# Altium schematic sheet SH29 - EXPANSION3.SchDoc
size 386 x 246 mm
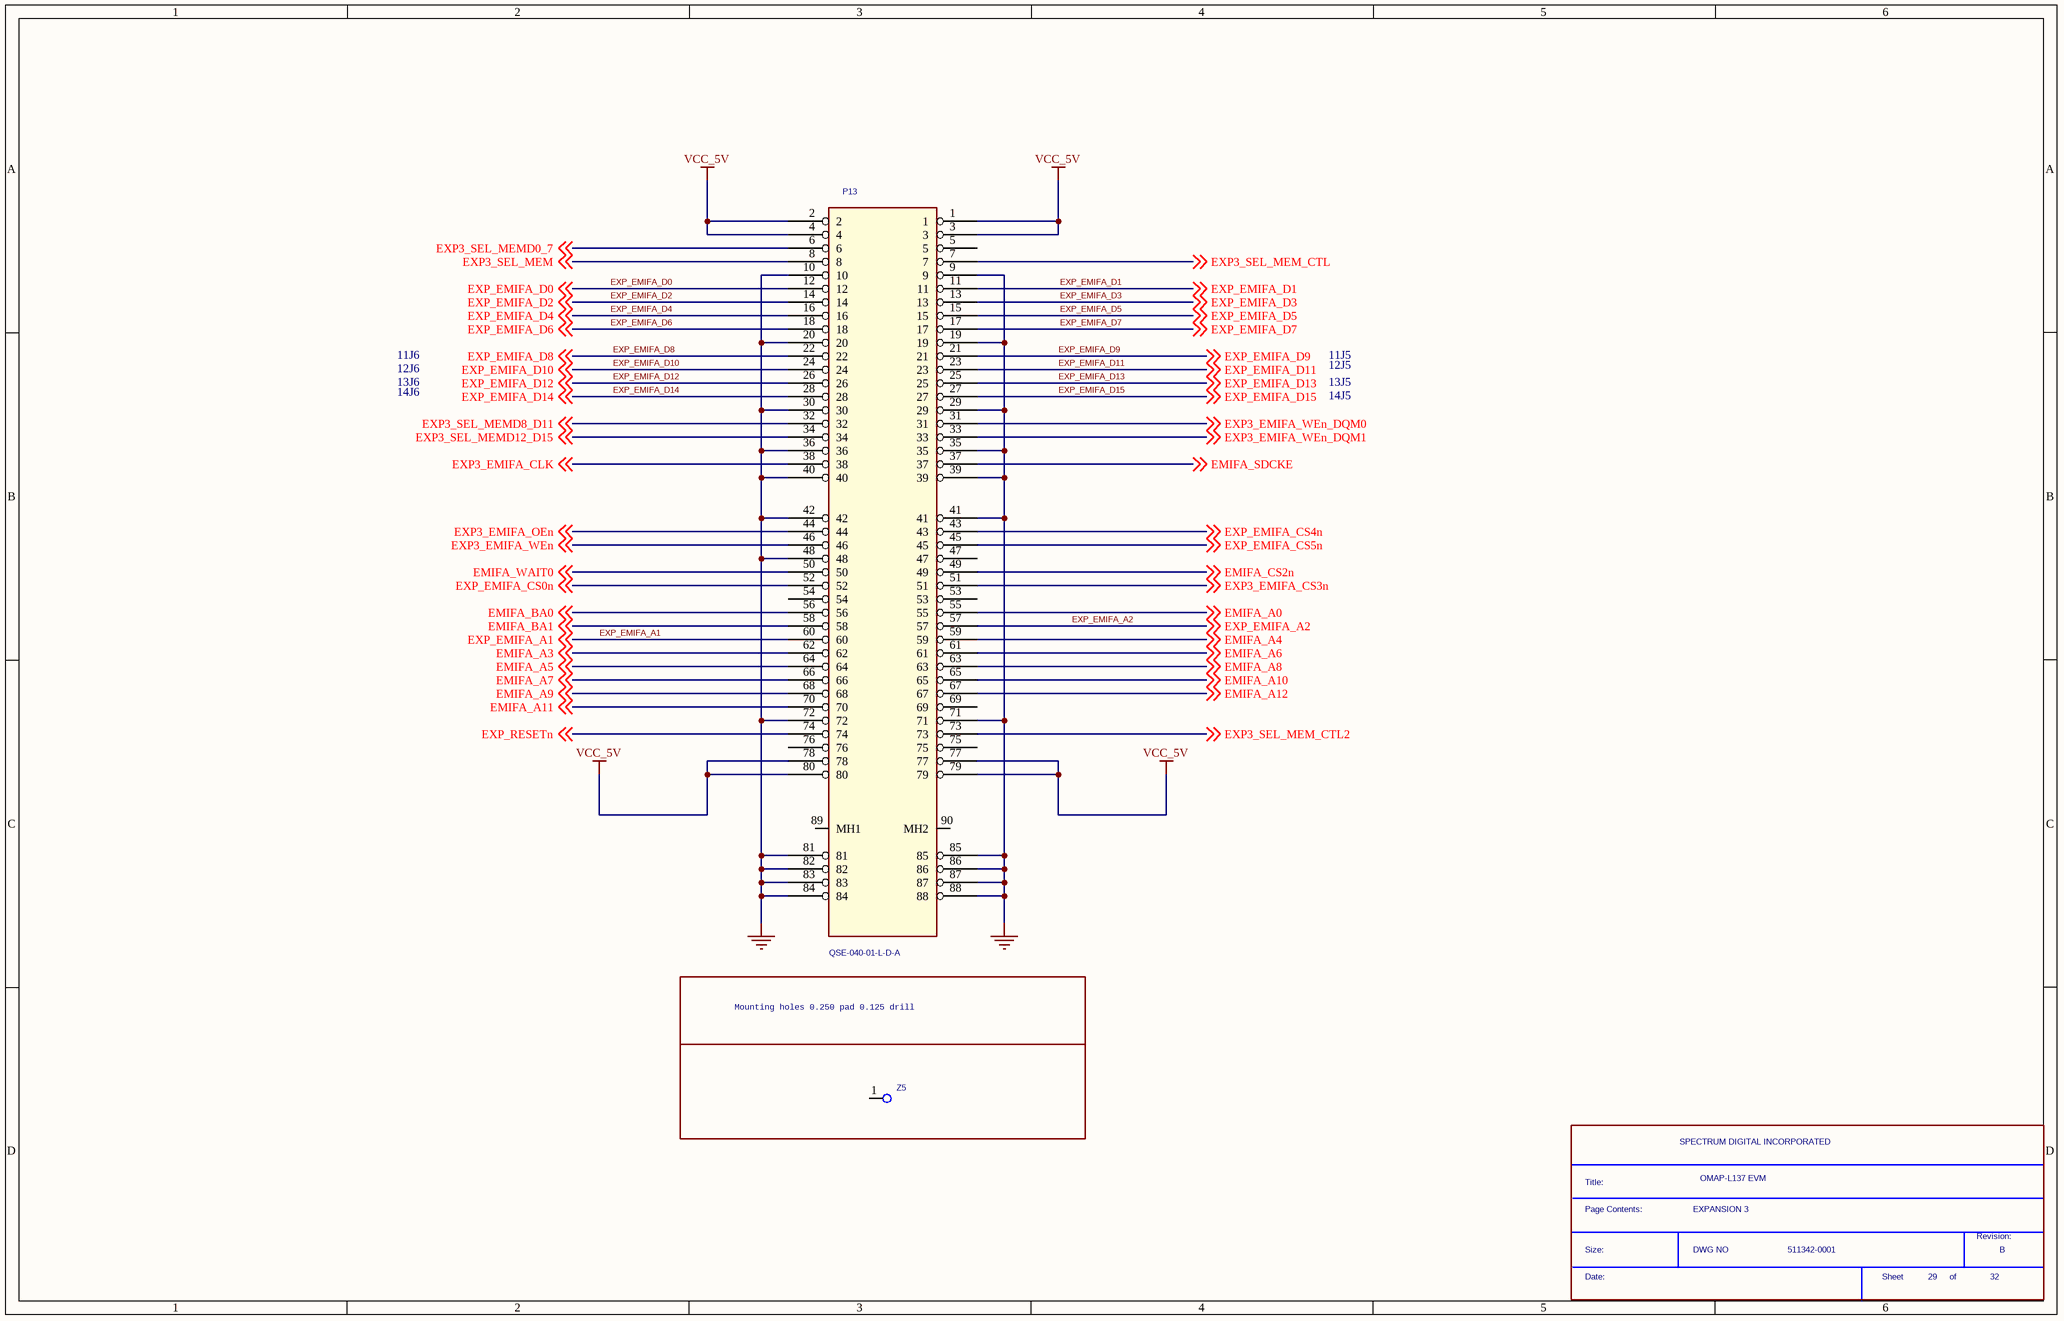
[diagram p0: SH29 - EXPANSION3.SchDoc]

## Parts
*  Page Contents:: EXPANSION 3  RevCode: B  Title: OMAP-L137 EVM  OrgName: SPECTRUM DIGITAL INCORPORATED  Doc: 511342-0001  Page Number: 29  Page Count: 32  (hidden comment: SDTitleBlock)  (graphical)
P13  QSE-040-01-L-D-A  [qse_040]
Z5  MNTHOLE  [TP1_0-2_0]  (value not drawn)

## Blocks framed on the sheet
Mounting holes 0.250 pad 0.125 drill: Z5

## Nets
GND: P13.9 P13.10 P13.19 P13.20 P13.29 P13.30 P13.35 P13.36 P13.39 P13.40 P13.41 P13.42 P13.48 P13.71 P13.72 P13.81 P13.82 P13.83 P13.84 P13.85 P13.86 P13.87 P13.88
VCC_5V: P13.1 P13.2 P13.3 P13.4 P13.77 P13.78 P13.79 P13.80
EMIFA_A0: P13.55 ; off-sheet EMIFA_A0
EMIFA_A3: P13.62 ; off-sheet EMIFA_A3
EMIFA_A4: P13.59 ; off-sheet EMIFA_A4
EMIFA_A5: P13.64 ; off-sheet EMIFA_A5
EMIFA_A6: P13.61 ; off-sheet EMIFA_A6
EMIFA_A7: P13.66 ; off-sheet EMIFA_A7
EMIFA_A8: P13.63 ; off-sheet EMIFA_A8
EMIFA_A9: P13.68 ; off-sheet EMIFA_A9
EMIFA_A10: P13.65 ; off-sheet EMIFA_A10
EMIFA_A11: P13.70 ; off-sheet EMIFA_A11
EMIFA_A12: P13.67 ; off-sheet EMIFA_A12
EMIFA_BA0: P13.56 ; off-sheet EMIFA_BA0
EMIFA_BA1: P13.58 ; off-sheet EMIFA_BA1
EMIFA_CS2n: P13.49 ; off-sheet EMIFA_CS2n
EMIFA_SDCKE: P13.37 ; off-sheet EMIFA_SDCKE
EMIFA_WAIT0: P13.50 ; off-sheet EMIFA_WAIT0
EXP3_EMIFA_CLK: P13.38 ; off-sheet EXP3_EMIFA_CLK
EXP3_EMIFA_CS3n: P13.51 ; off-sheet EXP3_EMIFA_CS3n
EXP3_EMIFA_OEn: P13.44 ; off-sheet EXP3_EMIFA_OEn
EXP3_EMIFA_WEn: P13.46 ; off-sheet EXP3_EMIFA_WEn
EXP3_EMIFA_WEn_DQM0: P13.31 ; off-sheet EXP3_EMIFA_WEn_DQM0
EXP3_EMIFA_WEn_DQM1: P13.33 ; off-sheet EXP3_EMIFA_WEn_DQM1
EXP3_SEL_MEM: P13.8 ; off-sheet EXP3_SEL_MEM
EXP3_SEL_MEM_CTL: P13.7 ; off-sheet EXP3_SEL_MEM_CTL
EXP3_SEL_MEM_CTL2: P13.73 ; off-sheet EXP3_SEL_MEM_CTL2
EXP3_SEL_MEMD0_7: P13.6 ; off-sheet EXP3_SEL_MEMD0_7
EXP3_SEL_MEMD8_D11: P13.32 ; off-sheet EXP3_SEL_MEMD8_D11
EXP3_SEL_MEMD12_D15: P13.34 ; off-sheet EXP3_SEL_MEMD12_D15
EXP_EMIFA_A1: P13.60 ; off-sheet EXP_EMIFA_A1
EXP_EMIFA_A2: P13.57 ; off-sheet EXP_EMIFA_A2
EXP_EMIFA_CS0n: P13.52 ; off-sheet EXP_EMIFA_CS0n
EXP_EMIFA_CS4n: P13.43 ; off-sheet EXP_EMIFA_CS4n
EXP_EMIFA_CS5n: P13.45 ; off-sheet EXP_EMIFA_CS5n
EXP_EMIFA_D0: P13.12 ; off-sheet EXP_EMIFA_D0
EXP_EMIFA_D1: P13.11 ; off-sheet EXP_EMIFA_D1
EXP_EMIFA_D2: P13.14 ; off-sheet EXP_EMIFA_D2
EXP_EMIFA_D3: P13.13 ; off-sheet EXP_EMIFA_D3
EXP_EMIFA_D4: P13.16 ; off-sheet EXP_EMIFA_D4
EXP_EMIFA_D5: P13.15 ; off-sheet EXP_EMIFA_D5
EXP_EMIFA_D6: P13.18 ; off-sheet EXP_EMIFA_D6
EXP_EMIFA_D7: P13.17 ; off-sheet EXP_EMIFA_D7
EXP_EMIFA_D8: P13.22 ; off-sheet EXP_EMIFA_D8
EXP_EMIFA_D9: P13.21 ; off-sheet EXP_EMIFA_D9
EXP_EMIFA_D10: P13.24 ; off-sheet EXP_EMIFA_D10
EXP_EMIFA_D11: P13.23 ; off-sheet EXP_EMIFA_D11
EXP_EMIFA_D12: P13.26 ; off-sheet EXP_EMIFA_D12
EXP_EMIFA_D13: P13.25 ; off-sheet EXP_EMIFA_D13
EXP_EMIFA_D14: P13.28 ; off-sheet EXP_EMIFA_D14
EXP_EMIFA_D15: P13.27 ; off-sheet EXP_EMIFA_D15
EXP_RESETn: P13.74 ; off-sheet EXP_RESETn

Not connected (* = marked no-connect by the designer): P13 5 47 53 54 69 75 76 89(MH1) 90(MH2); Z5 1

## Notes on the sheet
- 11J6
- 12J6
- 13J6
- 14J6
- 11J5
- 12J5
- 13J5
- 14J5
- (in symbol SDTitleBlock) Title:; Page Contents:; Revision:; Size:; DWG NO; Date:; Sheet; of

## Library data of the parts
P13 = QSE-040-01-L-D-A: Part #: 101881-0040R
Z5 = TestPoint1: ATLStockNo1: none